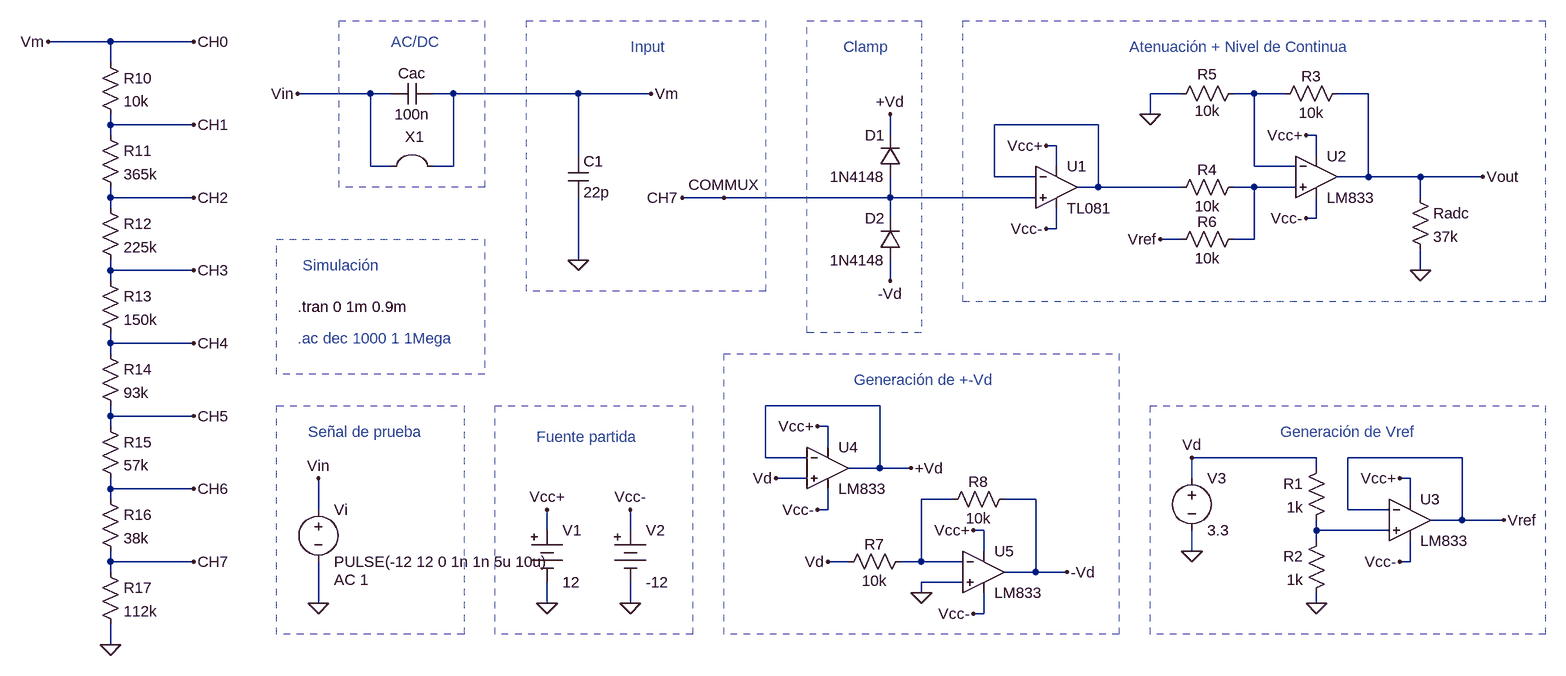
[diagram p0: schematic Etapa de Entrada v4.asc]
Etapa de Entrada v4.asc, the LTspice schematic file:
Version 4
SHEET 1 2812 916
WIRE -368 -80 -464 -80
WIRE -240 -80 -368 -80
WIRE -368 -48 -368 -80
WIRE 32 0 -80 0
WIRE 64 0 32 0
WIRE 160 0 128 0
WIRE 352 0 160 0
WIRE 464 0 352 0
WIRE 1280 0 1232 0
WIRE 1392 0 1360 0
WIRE 1440 0 1392 0
WIRE 1568 0 1520 0
WIRE 1232 32 1232 0
WIRE -368 48 -368 32
WIRE -240 48 -368 48
WIRE 1152 48 992 48
WIRE -368 64 -368 48
WIRE 832 64 832 32
WIRE 1488 64 1472 64
WIRE 1088 80 1072 80
WIRE 352 96 352 0
WIRE 1488 96 1488 64
WIRE 32 112 32 0
WIRE 64 112 32 112
WIRE 160 112 160 0
WIRE 160 112 128 112
WIRE 1088 112 1088 80
WIRE 1392 112 1392 0
WIRE 1456 112 1392 112
WIRE 992 128 992 48
WIRE 1056 128 992 128
WIRE 1568 128 1568 0
WIRE 1568 128 1520 128
WIRE 1648 128 1568 128
WIRE 1744 128 1648 128
WIRE 1152 144 1152 48
WIRE 1152 144 1120 144
WIRE 1280 144 1152 144
WIRE 1392 144 1360 144
WIRE 1456 144 1392 144
WIRE -368 160 -368 144
WIRE -240 160 -368 160
WIRE 576 160 512 160
WIRE 832 160 832 128
WIRE 832 160 576 160
WIRE 1056 160 832 160
WIRE 1648 160 1648 128
WIRE -368 176 -368 160
WIRE 832 192 832 160
WIRE 1488 192 1488 160
WIRE 1488 192 1472 192
WIRE 1088 208 1088 176
WIRE 1088 208 1072 208
WIRE 1280 224 1248 224
WIRE 1392 224 1392 144
WIRE 1392 224 1360 224
WIRE 352 256 352 160
WIRE -368 272 -368 256
WIRE -240 272 -368 272
WIRE 1648 272 1648 240
WIRE -368 288 -368 272
WIRE 832 288 832 256
WIRE -368 384 -368 368
WIRE -240 384 -368 384
WIRE -368 400 -368 384
WIRE 816 480 640 480
WIRE -368 496 -368 480
WIRE -240 496 -368 496
WIRE -368 512 -368 496
WIRE 736 512 720 512
WIRE 736 544 736 512
WIRE 640 560 640 480
WIRE 704 560 640 560
WIRE 1488 560 1296 560
WIRE 1712 560 1536 560
WIRE 816 576 816 480
WIRE 816 576 768 576
WIRE 864 576 816 576
WIRE 1488 576 1488 560
WIRE 704 592 656 592
WIRE 1296 592 1296 560
WIRE 1632 592 1616 592
WIRE -368 608 -368 592
WIRE -240 608 -368 608
WIRE -368 624 -368 608
WIRE 928 624 880 624
WIRE 1056 624 1008 624
WIRE 1632 624 1632 592
WIRE -48 640 -48 592
WIRE 736 640 736 608
WIRE 736 640 720 640
WIRE 1536 640 1536 560
WIRE 1600 640 1536 640
WIRE 1712 656 1712 560
WIRE 1712 656 1664 656
WIRE 1776 656 1712 656
WIRE 304 672 304 640
WIRE 432 672 432 640
WIRE 976 672 960 672
WIRE 1488 672 1488 656
WIRE 1600 672 1488 672
WIRE 1488 688 1488 672
WIRE 976 704 976 672
WIRE 1296 704 1296 672
WIRE -368 720 -368 704
WIRE -240 720 -368 720
WIRE 768 720 736 720
WIRE 880 720 880 624
WIRE 880 720 848 720
WIRE 944 720 880 720
WIRE 1632 720 1632 688
WIRE 1632 720 1616 720
WIRE -368 736 -368 720
WIRE 1056 736 1056 624
WIRE 1056 736 1008 736
WIRE 1104 736 1056 736
WIRE 944 752 880 752
WIRE 880 768 880 752
WIRE -48 784 -48 720
WIRE 304 784 304 752
WIRE 432 784 432 752
WIRE 1488 784 1488 768
WIRE 976 800 976 768
WIRE 976 800 960 800
WIRE -368 848 -368 816
FLAG -80 0 Vin
FLAG -48 592 Vin
FLAG -48 784 0
FLAG 1744 128 Vout
FLAG 352 256 0
FLAG 304 640 Vcc+
FLAG 432 640 Vcc-
FLAG 432 784 0
FLAG 304 784 0
FLAG 832 288 -Vd
FLAG 1072 80 Vcc+
FLAG 1072 208 Vcc-
FLAG 1248 224 Vref
FLAG 1296 704 0
FLAG 1616 592 Vcc+
FLAG 1616 720 Vcc-
FLAG 1648 272 0
FLAG 1472 64 Vcc+
FLAG 1472 192 Vcc-
FLAG 1776 656 Vref
FLAG 1232 32 0
FLAG 1488 784 0
FLAG -368 848 0
FLAG -240 -80 CH0
FLAG -240 48 CH1
FLAG -240 160 CH2
FLAG -240 272 CH3
FLAG -240 384 CH4
FLAG -240 496 CH5
FLAG -240 608 CH6
FLAG -240 720 CH7
FLAG -464 -80 Vm
FLAG 464 0 Vm
FLAG 512 160 CH7
FLAG 576 160 COMMUX
FLAG 1296 560 Vd
FLAG 832 32 +Vd
FLAG 720 512 Vcc+
FLAG 720 640 Vcc-
FLAG 864 576 +Vd
FLAG 656 592 Vd
FLAG 960 672 Vcc+
FLAG 960 800 Vcc-
FLAG 1104 736 -Vd
FLAG 880 768 0
FLAG 736 720 Vd
SYMBOL voltage -48 624 R0
WINDOW 123 24 124 Left 2
WINDOW 39 0 0 Left 0
SYMATTR Value2 AC 1
SYMATTR InstName Vi
SYMATTR Value PULSE(-12 12 0 1n 1n 5u 10u)
SYMBOL cap 128 -16 R90
WINDOW 0 0 32 VBottom 2
WINDOW 3 32 32 VTop 2
SYMATTR InstName Cac
SYMATTR Value 100n
SYMBOL Misc\\jumper 96 48 R0
WINDOW 0 4 34 Bottom 2
SYMATTR InstName X1
SYMBOL cap 336 96 R0
SYMATTR InstName C1
SYMATTR Value 22p
SYMBOL diode 848 128 R180
WINDOW 0 24 64 Left 2
WINDOW 3 24 0 Left 2
SYMATTR InstName D1
SYMATTR Value 1N4148
SYMBOL Misc\\battery 304 656 R0
WINDOW 123 0 0 Left 0
WINDOW 39 0 0 Left 0
SYMATTR InstName V1
SYMATTR Value 12
SYMBOL Misc\\battery 432 656 R0
WINDOW 123 0 0 Left 0
WINDOW 39 0 0 Left 0
SYMATTR InstName V2
SYMATTR Value -12
SYMBOL res 1264 240 R270
WINDOW 0 27 56 VTop 2
WINDOW 3 2 56 VBottom 2
SYMATTR InstName R6
SYMATTR Value 10k
SYMBOL voltage 1296 576 R0
WINDOW 123 0 0 Left 0
WINDOW 39 0 0 Left 0
SYMATTR InstName V3
SYMATTR Value 3.3
SYMBOL res 1632 144 R0
SYMATTR InstName Radc
SYMATTR Value 37k
SYMBOL res 1424 16 R270
WINDOW 0 27 56 VTop 2
WINDOW 3 2 56 VBottom 2
SYMATTR InstName R3
SYMATTR Value 10k
SYMBOL res 1264 160 R270
WINDOW 0 27 56 VTop 2
WINDOW 3 2 56 VBottom 2
SYMATTR InstName R4
SYMATTR Value 10k
SYMBOL diode 848 256 R180
WINDOW 0 24 64 Left 2
WINDOW 3 24 0 Left 2
SYMATTR InstName D2
SYMATTR Value 1N4148
SYMBOL TCLib\\LM833 1632 656 R0
SYMATTR InstName U3
SYMBOL TCLib\\LM833 1488 128 R0
SYMATTR InstName U2
SYMBOL AutoGenerated\\TL081 1088 144 R0
SYMATTR InstName U1
SYMBOL res 1376 -16 R90
WINDOW 0 2 56 VBottom 2
WINDOW 3 27 56 VTop 2
SYMATTR InstName R5
SYMATTR Value 10k
SYMBOL res 1504 560 M0
SYMATTR InstName R1
SYMATTR Value 1k
SYMBOL res 1504 672 M0
SYMATTR InstName R2
SYMATTR Value 1k
SYMBOL res -384 -64 R0
SYMATTR InstName R10
SYMATTR Value 10k
SYMBOL res -384 48 R0
SYMATTR InstName R11
SYMATTR Value 365k
SYMBOL res -384 160 R0
SYMATTR InstName R12
SYMATTR Value 225k
SYMBOL res -384 272 R0
SYMATTR InstName R13
SYMATTR Value 150k
SYMBOL res -384 384 R0
SYMATTR InstName R14
SYMATTR Value 93k
SYMBOL res -384 496 R0
SYMATTR InstName R15
SYMATTR Value 57k
SYMBOL res -384 608 R0
SYMATTR InstName R16
SYMATTR Value 38k
SYMBOL res -384 720 R0
SYMATTR InstName R17
SYMATTR Value 112k
SYMBOL TCLib\\LM833 736 576 R0
SYMATTR InstName U4
SYMBOL TCLib\\LM833 976 736 R0
SYMATTR InstName U5
SYMBOL res 912 640 R270
WINDOW 0 27 56 VTop 2
WINDOW 3 2 56 VBottom 2
SYMATTR InstName R8
SYMATTR Value 10k
SYMBOL res 752 736 R270
WINDOW 0 27 56 VTop 2
WINDOW 3 2 56 VBottom 2
SYMATTR InstName R7
SYMATTR Value 10k
TEXT -80 328 Left 2 !.tran 0 1m 0.9m
TEXT -80 376 Left 2 ;.ac dec 1000 1 1Mega
TEXT 760 -72 Left 2 ;Clamp
TEXT 64 -80 Left 2 ;AC/DC
TEXT 432 -72 Left 2 ;Input
TEXT 1200 -72 Left 2 ;Atenuación + Nivel de Continua
TEXT 1432 520 Left 2 ;Generación de Vref
TEXT 288 528 Left 2 ;Fuente partida
TEXT -64 520 Left 2 ;Señal de prueba
TEXT -72 264 Left 2 ;Simulación
TEXT 776 440 Left 2 ;Generación de +-Vd
RECTANGLE Normal 880 368 704 -112 3
RECTANGLE Normal 208 144 -16 -112 3
RECTANGLE Normal 640 304 272 -112 3
RECTANGLE Normal 1840 320 944 -112 3
RECTANGLE Normal 1840 832 1232 480 3
RECTANGLE Normal 528 832 224 480 3
RECTANGLE Normal 176 832 -112 480 3
RECTANGLE Normal 208 432 -112 224 3
RECTANGLE Normal 1184 832 576 400 3

The netlist it stands for:
* Etapa de Entrada v4.asc
Vi Vm 0 PULSE(-12 12 0 1n 1n 5u 10u) AC 1
Cac Vm Vm 100n
C1 Vm 0 22p
D1 COMMUX +Vd 1N4148
V1 Vcc+ 0 12
V2 Vcc- 0 -12
R6 Vref N003 10k
V3 Vd 0 3.3
Radc Vout 0 37k
R3 N001 Vout 10k
R4 N002 N003 10k
D2 -Vd COMMUX 1N4148
* U3: LM833 (symbol TCLib\LM833 not available, pins judged from their places): In+=N005 In-=Vref V+=Vcc+ V-=Vcc- OUT=Vref
* U2: LM833 (symbol TCLib\LM833 not available, pins judged from their places): In+=N003 In-=N001 V+=Vcc+ V-=Vcc- OUT=Vout
* U1: TL081 (symbol AutoGenerated\TL081 not available, pins judged from their places): In+=COMMUX In-=N002 V+=Vcc+ V-=Vcc- OUT=N002
R5 N001 0 10k
R1 Vd N005 1k
R2 N005 0 1k
R10 Vm CH1 10k
R11 CH1 CH2 365k
R12 CH2 CH3 225k
R13 CH3 CH4 150k
R14 CH4 CH5 93k
R15 CH5 CH6 57k
R16 CH6 COMMUX 38k
R17 COMMUX 0 112k
* U4: LM833 (symbol TCLib\LM833 not available, pins judged from their places): In+=Vd In-=+Vd V+=Vcc+ V-=Vcc- OUT=+Vd
* U5: LM833 (symbol TCLib\LM833 not available, pins judged from their places): In+=0 In-=N004 V+=Vcc+ V-=Vcc- OUT=-Vd
R8 N004 -Vd 10k
R7 Vd N004 10k
.model D D
.lib standard.dio
.tran 0 1m 0.9m
* .ac dec 1000 1 1Mega
* Clamp
* AC/DC
* Input
* Atenuación + Nivel de Continua
* Generación de Vref
* Fuente partida
* Señal de prueba
* Simulación
* Generación de +-Vd
.backanno
.end